# Altium schematic sheet [1]esp32.SchDoc
size A4
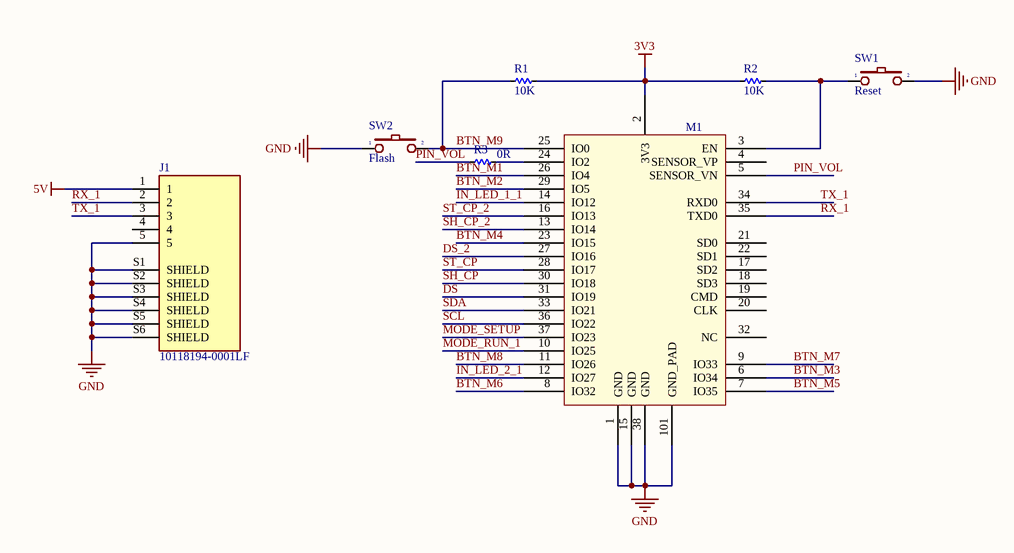
[diagram p0: [1]esp32.SchDoc]

## Parts
J1  10118194-0001LF  [AMPHENOL_10118194-0001LF]
M1  ESP32S_Module  [ESP32S]  (value not drawn)
R1  10K  [RES-SMD-0603]
R2  10K  [RES-SMD-0603]
R3  0R  [RES-SMD-0603]
SW1  Reset  [SW1-SMD]
SW2  Flash  [SW-DIP1-1]

## Nets
3V3: M1.2(3V3) R1.1 R2.2
5V: J1.1
GND: J1.5 J1.S1(SHIELD) J1.S2(SHIELD) J1.S3(SHIELD) J1.S4(SHIELD) J1.S5(SHIELD) J1.S6(SHIELD) M1.1(GND) M1.15(GND) M1.38(GND) M1.101(GND_PAD) SW1.2 SW2.1
BTN_M1: M1.26(IO4)
BTN_M2: M1.29(IO5)
BTN_M3: M1.6(IO34)
BTN_M4: M1.23(IO15)
BTN_M5: M1.7(IO35)
BTN_M6: M1.8(IO32)
BTN_M7: M1.9(IO33)
BTN_M8: M1.11(IO26)
BTN_M9: M1.25(IO0) R1.2 SW2.2
DS: M1.31(IO19)
DS_2: M1.27(IO16)
IN_LED_1_1: M1.14(IO12)
IN_LED_2_1: M1.12(IO27)
MODE_RUN_1: M1.10(IO25)
MODE_SETUP: M1.37(IO23)
PIN_VOL: M1.5(SENSOR_VN) R3.1
RX_1: J1.2 M1.35(TXD0)
SCL: M1.36(IO22)
SDA: M1.33(IO21)
SH_CP: M1.30(IO18)
SH_CP_2: M1.13(IO14)
ST_CP: M1.28(IO17)
ST_CP_2: M1.16(IO13)
TX_1: J1.3 M1.34(RXD0)
NetM1_3: M1.3(EN) R2.1 SW1.1
NetM1_24: M1.24(IO2) R3.2

Not connected (* = marked no-connect by the designer): J1 4; M1 4(SENSOR_VP) 17(SD2) 18(SD3) 19(CMD) 20(CLK) 21(SD0) 22(SD1) 32(NC)

## Library data of the parts
J1 = 10118194-0001LF: USB - micro B USB 2.0 Receptacle Connector 5 Position Surface Mount, Right Angle; Through Hole; MF: Amphenol ICC; Package: None; Price: None; Availability: Unavailable; MP: 10118194-0001LF; SnapEDA_Link: https://www.snapeda.com/parts/10118194-0001LF/Amphenol%20FCI/view-part/1413308/?ref=snap; Value: *
M1 = ESP32S_Module: Esp-32S; Datasheet: https://espressif.com/sites/default/files/documentation/esp_wroom_32_datasheet_en.pdf
R1-R3 = Res-SMD: Resistor; Manufacturer: Generic Components; Class: Passive; Published: 08/06/2000; Publisher: Altium Hobart Technology Centre
SW1 SW2 = SW2: Switch button 2 pin; Value: SW chip 2 pin